# Altium schematic sheet BUZZER.SchDoc
size A; SheetNumber: 13; SheetTotal: 31
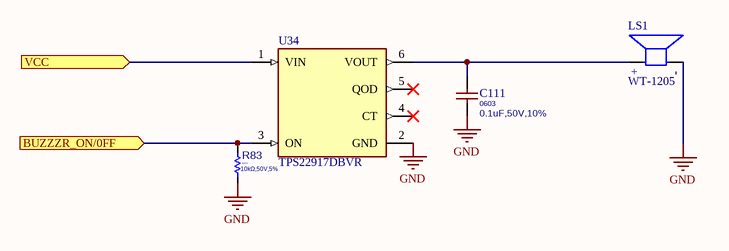
[diagram p0: BUZZER.SchDoc]

## Parts
C111  Package: 0603  [C0603]  (hidden comment: 0.1uF,50V,10%)
LS1  WT-1205  [XDCR_AT-1224-TWT-5V-2-R]
R83  value 10kΩ,50V,5%  Package: 0402  [R0402]  (hidden comment: 10kΩ)
U34  TPS22917DBVR  [SOT95P280X145-6N]

## Ports
BUZZZR_ON/0FF (in), VCC (in)

## Nets
GND: C111.1 LS1.N R83.1 U34.2(GND)
BUZZZR_ON/0FF: R83.2 U34.3(ON) ; port BUZZZR_ON/0FF
VCC: U34.1(VIN) ; port VCC
NetC111_2: C111.2 LS1.P U34.6(VOUT)

Not connected (* = marked no-connect by the designer): U34 4(CT)* 5(QOD)*

## Notes on the sheet
- (in symbol WT-1205) +; -

## Library data of the parts
C111 = GCM188R71H104KA57J: CAP CER 0.1UF 50V X7R 0603; Manufacturer: Murata Electronics; Type: SM; Min Operating Temp: -55°C; Max Operating Temp: 125°C; MPN: GCM188R71H104KA57J; Datasheet: https://datasheet.lcsc.com/lcsc/2404081050_Murata-Electronics-GCM188R71H104KA57J_C3011652.pdf; LCSC: C3011652; Value: 0.1uF,50V,10%
LS1 = WT-1205: Buzzers Transducer, Externally Driven Magnetic 5 V 50mA 2.4kHz 87dB @ 5V, 10cm Through Hole PC Pins; MP: AT-1224-TWT-5V-2-R; Package: None; Price: None; Value: *; Availability: Unavailable
R83 = RC0402JR-0710KL: 62.5mW Thick Film Resistors 50V ±100ppm/℃ ±5% 10kΩ 0402 Chip Resistor - Surface Mount ROHS; Manufacturer: YAGEO; MPN: RC0402JR-0710KL; Max Operating Temp: +155; Min Operating Temp: -55; Datasheet: https://datasheet.lcsc.com/lcsc/1810241334_YAGEO-RC0402JR-0710KL_C60489.pdf; LCSC: C60489
U34 = TPS22917DBVR: 5.5-V, 2-A, 80-mÎ© , 10-nA leakage load switch adj. rise time and adj output discharge; MF: Texas Instruments; SnapEDA_Link: https://www.snapeda.com/parts/TPS22917DBVR/Texas+Instruments/view-part/?ref=snap; Package: SOT-23-6 Texas Instruments; Value: *; MP: TPS22917DBVR; Check_prices: https://www.snapeda.com/parts/TPS22917DBVR/Texas+Instruments/view-part/?ref=eda